# Altium schematic sheet Feeder.SchDoc
size A3; SheetNumber: 1; SheetTotal: 1
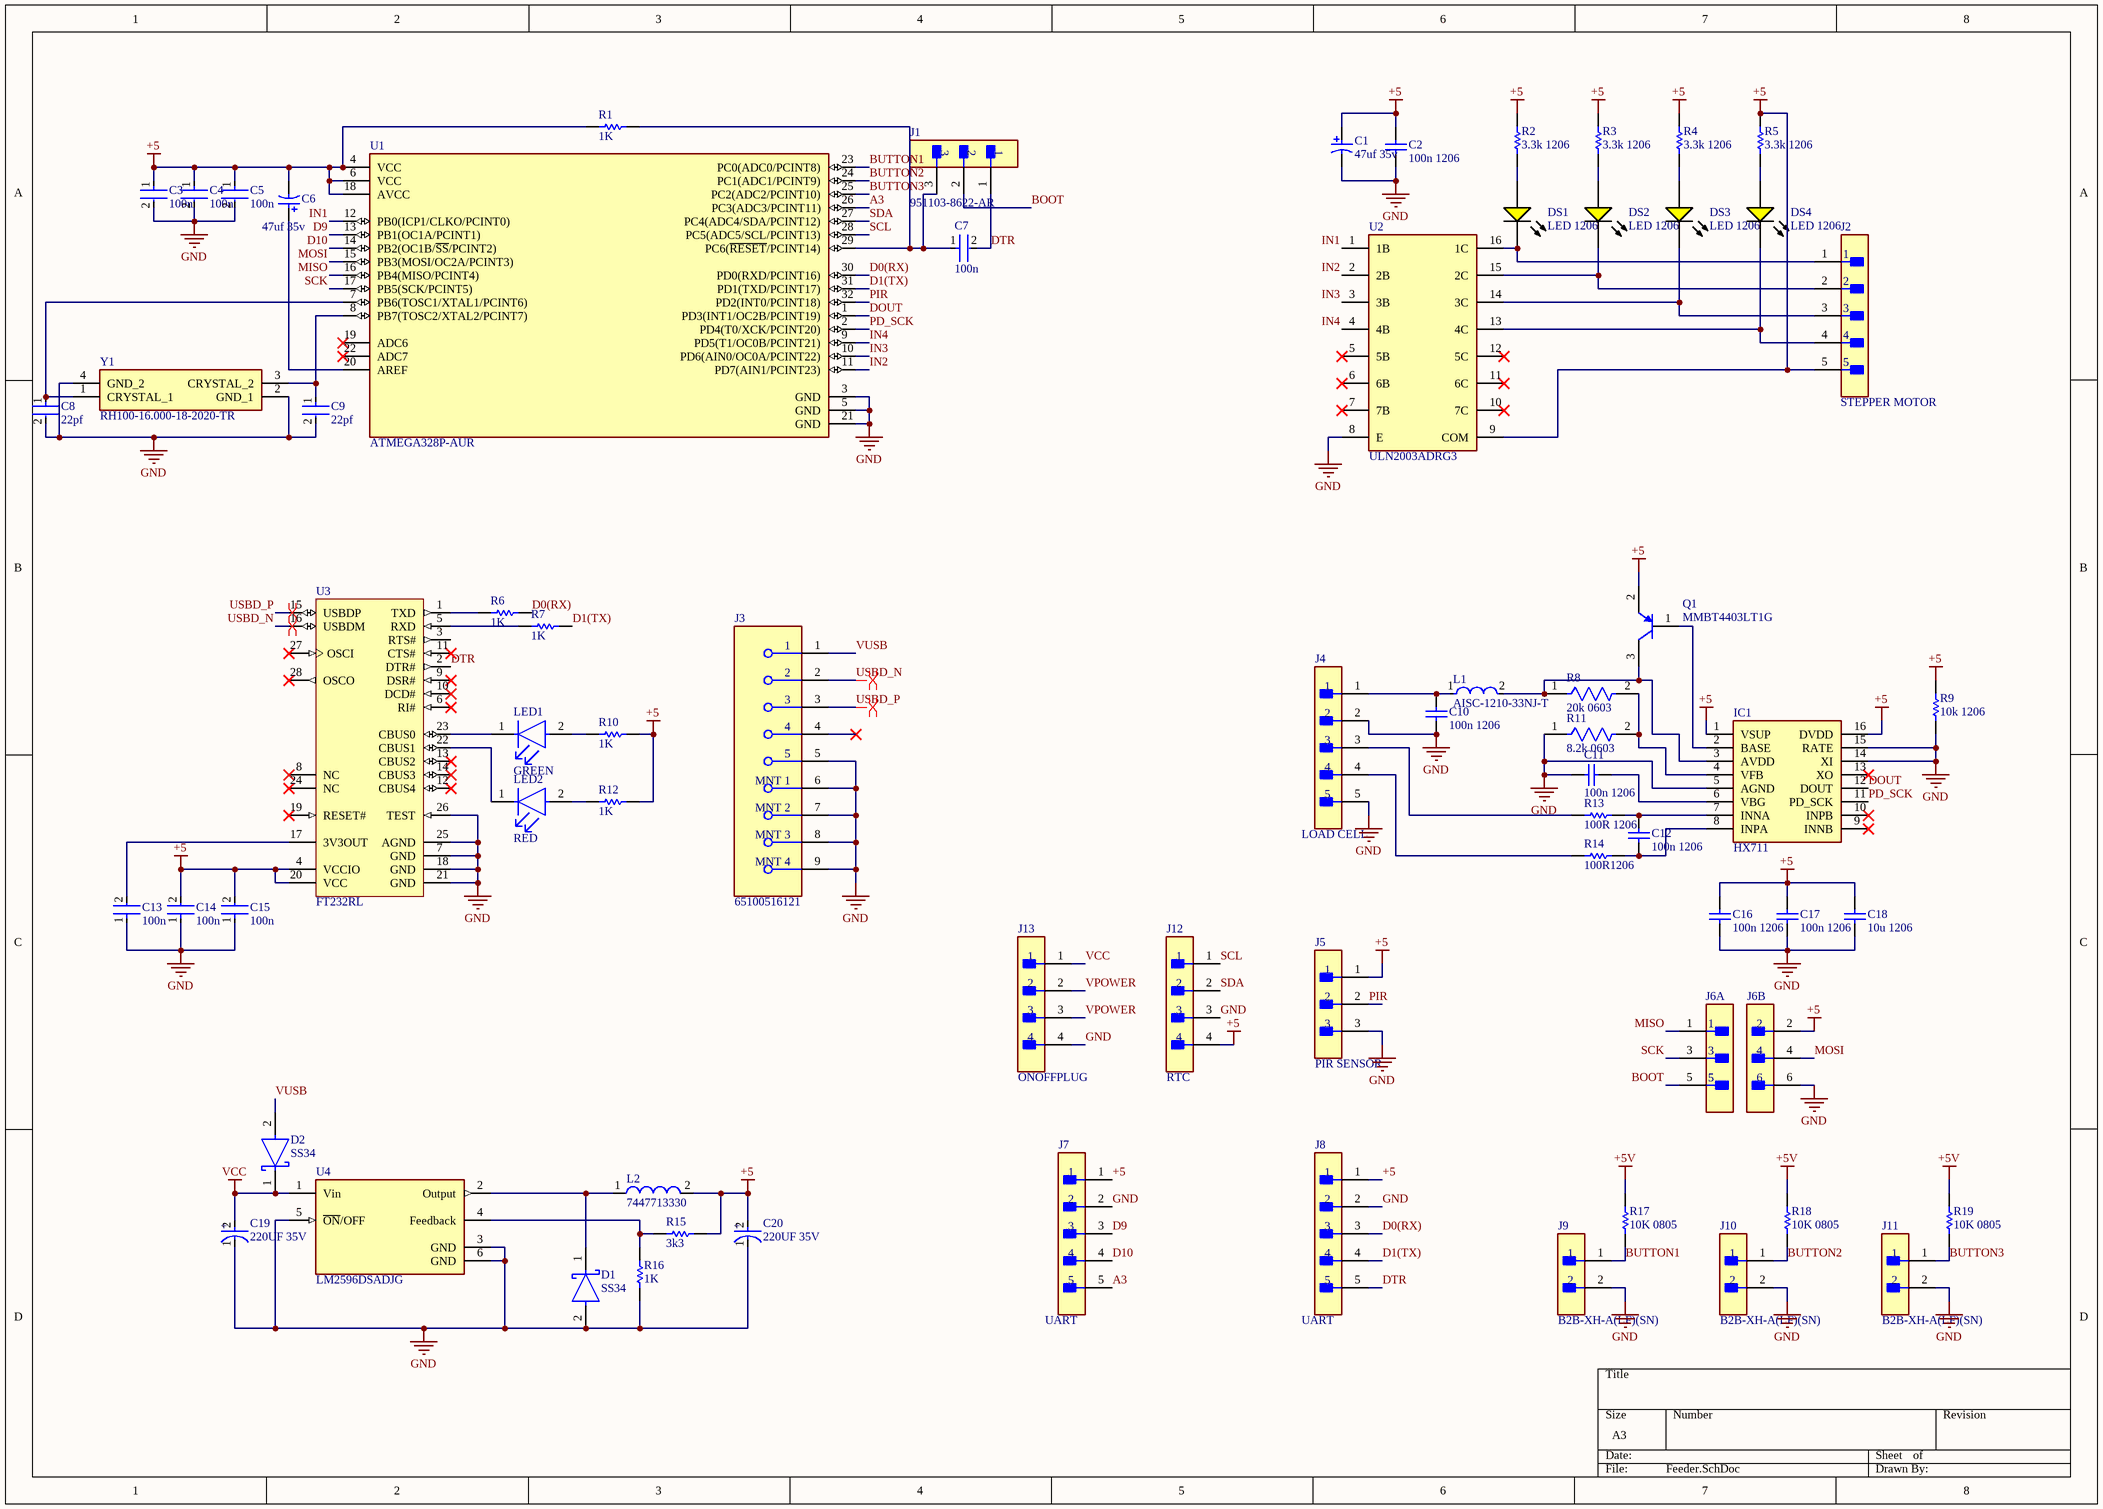
[diagram p0: Feeder.SchDoc]

## Parts
C1  47uf 35v  [NIC-CAPA2-6.3X5.8_V]
C2  100n 1206  [CAPC3216X190X55ML30T25]
C3  100n  [FP-C1206C-EB-MFG]
C4  100n  [FP-C1206C-EB-MFG]
C5  100n  [FP-C1206C-EB-MFG]
C6  47uf 35v  [NIC-CAPA2-6.3X5.8_V]
C7  100n  [FP-C1206C-EB-MFG]
C8  22pf  [FP-C1206C-EB-MFG]
C9  22pf  [FP-C1206C-EB-MFG]
C10  100n 1206  [CAPC3216X190X55ML30T25]
C11  100n 1206  [CAPC3216X190X55ML30T25]
C12  100n 1206  [CAPC3216X190X55ML30T25]
C13  100n  [FP-C1206C-EB-MFG]
C14  100n  [FP-C1206C-EB-MFG]
C15  100n  [FP-C1206C-EB-MFG]
C16  100n 1206  [CAPC3216X190X55ML30T25]
C17  100n 1206  [CAPC3216X190X55ML30T25]
C18  10u 1206  [CAPC3216X190X55ML30T25]
C19  220UF 35V  [FP-FC-G-MFG]
C20  220UF 35V  [FP-FC-G-MFG]
D1  SS34  [FP-SS34LWH-MFG]
D2  SS34  [FP-SS34LWH-MFG]
DS1  LED 1206  [LUMX-SML-LX1206YC-TR_V]
DS2  LED 1206  [LUMX-SML-LX1206YC-TR_V]
DS3  LED 1206  [LUMX-SML-LX1206YC-TR_V]
DS4  LED 1206  [LUMX-SML-LX1206YC-TR_V]
IC1  HX711  [SOIC127P600X160-16N]
J1  951103-8622-AR  [FP-951103-8622-AR-MFG]
J2  STEPPER MOTOR  [FP-B5B-XH-AM_LF_SN-MFG]
J3  65100516121  [FP-65100516121-MFG]
J4  LOAD CELL  [FP-B5B-XH-AM_LF_SN-MFG]
J5  PIR SENSOR  [FP-B3B-XH-A_LF_SN-MFG]
J6  (no value)  [FP-90130-1206-MFG]  (parts A,B of 2)
J7  UART  [FP-B5B-XH-AM_LF_SN-MFG]
J8  UART  [FP-B5B-XH-AM_LF_SN-MFG]
J9  B2B-XH-A(LF)(SN)  [FP-B2B-XH-A_LF_SN-MFG]
J10  B2B-XH-A(LF)(SN)  [FP-B2B-XH-A_LF_SN-MFG]
J11  B2B-XH-A(LF)(SN)  [FP-B2B-XH-A_LF_SN-MFG]
J12  RTC  [FP-B4B-XH-A_LF_SN-MFG]
J13  ONOFFPLUG  [FP-B4B-XH-A_LF_SN-MFG]
L1  AISC-1210-33NJ-T  [FP-AISC-1210-MFG]
L2  7447713330  [WE-PD 1030]
LED1  GREEN  [FP-150120GS75000-MFG]
LED2  RED  [FP-150120GS75000-MFG]
Q1  MMBT4403LT1G  [ONSC-SOT-23-3-318-08_V]
R1  1K  [RESC3216X70X50LL05T20]
R2  3.3k 1206  [RESC3116X65X40ML10T20]
R3  3.3k 1206  [RESC3116X65X40ML10T20]
R4  3.3k 1206  [RESC3116X65X40ML10T20]
R5  3.3k 1206  [RESC3116X65X40ML10T20]
R6  1K  [RESC3216X70X50LL05T20]
R7  1K  [RESC3216X70X50LL05T20]
R8  20k 0603  [FP-RC0603-0_55-IPC_C]
R9  10k 1206  [RESC3116X65X40ML10T20]
R10  1K  [RESC3216X70X50LL05T20]
R11  8.2k 0603  [FP-RC0603-0_55-IPC_C]
R12  1K  [RESC3216X70X50LL05T20]
R13  100R 1206  [RESC3116X65X40ML10T20]
R14  100R1206  [RESC3116X65X40ML10T20]
R15  3k3  [RESC3216X70X50LL05T20]
R16  1K  [RESC3216X70X50LL05T20]
R17  10K 0805  [RESC2013X60X35NL10T20]
R18  10K 0805  [RESC2013X60X35NL10T20]
R19  10K 0805  [RESC2013X60X35NL10T20]
U1  ATMEGA328P-AUR  [FP-32A-IPC_C]
U2  ULN2003ADRG3  [FP-D0016A-IPC_A]
U3  FT232RL  [FTDI-SSOP-28_M]
U4  LM2596DSADJG  [FP-936A-02-MFG]
Y1  RH100-16.000-18-2020-TR  [RH10012000182020TR]

## Nets
+5: C1.1 C2.2 C3.1 C4.1 C5.1 C6.2 C14.2 C15.2 C16.2 C17.2 C18.2 C20.2(A) IC1.1(VSUP) IC1.16(DVDD) J2.5 J5.1 J6.2 J7.1 J8.1 J12.4 L2.2 Q1.2(E) R1.1 R2.2 R3.2 R4.2 R5.2 R9.2 R10.2 R12.2 R15.2 U1.4(VCC) U1.6(VCC) U1.18(AVCC) U2.9(COM) U3.4(VCCIO) U3.20(VCC)
+5V: R17.2 R18.2 R19.2
GND: C1.2 C2.1 C3.2 C4.2 C5.2 C8.2 C9.2 C10.1 C11.2 C13.1 C14.1 C15.1 C16.1 C17.1 C18.1 C19.1(C) C20.1(C) D1.2(A) IC1.5(AGND) IC1.14(XI) IC1.15(RATE) J3.5 J3.6(MNT_1) J3.7(MNT_2) J3.8(MNT_3) J3.9(MNT_4) J4.2 J4.5 J5.3 J6.6 J7.2 J8.2 J9.2 J10.2 J11.2 J12.3 J13.4 R9.1 R11.1 R16.1 U1.3(GND) U1.5(GND) U1.21(GND) U2.8(E) U3.7(GND) U3.18(GND) U3.21(GND) U3.25(AGND) U3.26(TEST) U4.3(GND) U4.5(~{ON}/OFF) U4.6(GND) Y1.2(GND_1) Y1.4(GND_2)
VCC: C19.2(A) D2.1(C) J13.1 U4.1(Vin)
A3: J7.5 U1.26(PC3(ADC3/PCINT11))
BOOT: J1.2 J6.5
BUTTON1: J9.1 R17.1 U1.23(PC0(ADC0/PCINT8))
BUTTON2: J10.1 R18.1 U1.24(PC1(ADC1/PCINT9))
BUTTON3: J11.1 R19.1 U1.25(PC2(ADC2/PCINT10))
D0(RX): J8.3 R6.2 U1.30(PD0(RXD/PCINT16))
D1(TX): J8.4 R7.2 U1.31(PD1(TXD/PCINT17))
D9: J7.3 U1.13(PB1(OC1A/PCINT1))
D10: J7.4 U1.14(PB2(OC1B/~{SS}/PCINT2))
DOUT: IC1.12(DOUT) U1.1(PD3(INT1/OC2B/PCINT19))
DTR: C7.2 J1.1 J8.5 U3.2(DTR#)
IN1: U1.12(PB0(ICP1/CLKO/PCINT0)) U2.1(1B)
IN2: U1.11(PD7(AIN1/PCINT23)) U2.2(2B)
IN3: U1.10(PD6(AIN0/OC0A/PCINT22)) U2.3(3B)
IN4: U1.9(PD5(T1/OC0B/PCINT21)) U2.4(4B)
MISO: J6.1 U1.16(PB4(MISO/PCINT4))
MOSI: J6.4 U1.15(PB3(MOSI/OC2A/PCINT3))
PD_SCK: IC1.11(PD_SCK) U1.2(PD4(T0/XCK/PCINT20))
PIR: J5.2 U1.32(PD2(INT0/PCINT18))
SCK: J6.3 U1.17(PB5(SCK/PCINT5))
SCL: J12.1 U1.28(PC5(ADC5/SCL/PCINT13))
SDA: J12.2 U1.27(PC4(ADC4/SDA/PCINT12))
USBD_N: J3.2 U3.16(USBDM)
USBD_P: J3.3 U3.15(USBDP)
VPOWER: J13.2 J13.3
VUSB: D2.2(A) J3.1
NetC6_1: C6.1 U1.20(AREF)
NetC7_1: C7.1 J1.3 R1.2 U1.29(PC6(~{RESET}/PCINT14))
NetC8_1: C8.1 U1.7(PB6(TOSC1/XTAL1/PCINT6)) Y1.1(CRYSTAL_1)
NetC9_1: C9.1 U1.8(PB7(TOSC2/XTAL2/PCINT7)) Y1.3(CRYSTAL_2)
NetC10_2: C10.2 J4.1 L1.1
NetC11_1: C11.1 IC1.6(VBG)
NetC12_1: C12.1 IC1.8(INPA) R14.2
NetC12_2: C12.2 IC1.7(INNA) R13.2
NetC13_2: C13.2 U3.17(3V3OUT)
NetD1_1: D1.1(C) L2.1 U4.2(Output)
NetDS1_1: DS1.1(A) R2.1
NetDS1_2: DS1.2(K) J2.1 U2.16(1C)
NetDS2_1: DS2.1(A) R3.1
NetDS2_2: DS2.2(K) J2.2 U2.15(2C)
NetDS3_1: DS3.1(A) R4.1
NetDS3_2: DS3.2(K) J2.3 U2.14(3C)
NetDS4_1: DS4.1(A) R5.1
NetDS4_2: DS4.2(K) J2.4 U2.13(4C)
NetIC1_2: IC1.2(BASE) Q1.1(B)
NetIC1_3: IC1.3(AVDD) L1.2 Q1.3(C) R8.1
NetIC1_4: IC1.4(VFB) R8.2 R11.2
NetJ4_3: J4.3 R13.1
NetJ4_4: J4.4 R14.1
NetLED1_1: LED1.1(C) U3.23(CBUS0)
NetLED1_2: LED1.2(A) R10.1
NetLED2_1: LED2.1(C) U3.22(CBUS1)
NetLED2_2: LED2.2(A) R12.1
NetR6_1: R6.1 U3.1(TXD)
NetR7_1: R7.1 U3.5(RXD)
NetR15_1: R15.1 R16.2 U4.4(Feedback)

Not connected (* = marked no-connect by the designer): IC1 9(INNB)* 10(INPB)* 13(XO)*; J3 4*; U1 19(ADC6)* 22(ADC7)*; U2 5(5B)* 6(6B)* 7(7B)* 10(7C)* 11(6C)* 12(5C)*; U3 3(RTS#) 6(RI#)* 8(NC)* 9(DSR#)* 10(DCD#)* 11(CTS#)* 12(CBUS4)* 13(CBUS2)* 14(CBUS3)* 19(RESET#)* 24(NC)* 27(OSCI)* 28(OSCO)*

## Layout directives
differential pair: USBD_N, USBD_P

## Notes on the sheet
- (in symbol CMP-05427-002152-1) +

## Library data of the parts
C1 C6 = CMP-0687-00032-1: Aluminum Electrolytic Capacitor, UD Series, Low Impedance, 47 uF, 35 V, + / - 20%, -55 to 105 degC, Chip Type, 6.3 x 5.8 mm D x L, Pb-Free, Reel; Manufacturer: Nichicon; PartNumber: UUD1V470MCL1GS; Rated Ripple Current (at 100kHz): 230 mA; Endurance Time: 2000 h; Impedance: 0.44 Ohm; Tolerance Rated Capacitance: -20 to 20%; Packing: Dia382mm Reel; DatasheetVersion: 08/2012; Length: 5.8 mm; ComponentLink2URL: http://products.nichicon.co.jp/en/pdf/XJA043/e-ud.pdf; PackageDescription: 2-Pin Surface Mount Device, Diameter 6.3 mm, Height 5.8 mm, Pitch 5.4 mm; ComponentLink2Description: Datasheet; Diameter: 6.3 mm; ComponentLink1URL: http://www.nichicon.co.jp/; Rated Voltage: 35 V; Mounting Technology: Surface Mount; ComponentLink3Description: Package Specification; ComponentLink1Description: Manufacturer URL; ComponentLink3URL: http://products.nichicon.co.jp/en/pdf/XJA043/e-ud.pdf; RoHS: TRUE; PackageReference: CAPAE-D6.3H5.8; Rated Capacitance: 47 uF
C2 C10-C12 C16 C17 = CMP-1662-00011-2: Chip Capacitor, 100 uF, +/- 20%, 6.3 V, -55 to 85 degC, 1206 (3216 Metric), RoHS, Tape and Reel; PartNumber: GRM31CR60J107ME39L; Case\/Package: 1206; Capacitance: 100 uF; Voltage Rating (DC): 6.3 V; Type (Capacitors): X5R; REACH SVHC: No SVHC; Height: 1.6 mm; Tolerance: 20%; Packaging: Tape and Reel; Mount: Surface Mount; PackageDescription: 2-Pin Surface Mount Device, Body 3.2 x 1.6 mm; ComponentLink1URL: http://www.murata.com/; Pins: 2; ComponentLink2Description: Datasheet; PackageReference: 1206; Width: 1.6 mm; Package Quantity: 2000; Min Operating Temperature: -55 degC; Case Code (Imperial): 1206; Max Operating Temperature: 85 degC; DatasheetVersion: 09/2016; Mounting Technology: Surface Mount; Voltage Rating: 6.3 V; ComponentLink1Description: Manufacturer URL; Radiation Hardening: No; Case Code (Metric): 3216; Length: 3.2 mm; ComponentLink2URL: http://psearch.en.murata.com/capacitor/product/GRM31CR60J107ME39%23.pdf; RoHSCompliant: true
C3-C5 C7 C13-C15 = CMP-1037-04189-2: CAP CER 0.1UF 25V 5% NP0 1206; Manufacturer: KEMET; Manufacturer Part Number: C1206C104J3GACTU; Value: 0.10 μF; Tolerance: 0.05; Temperature Coefficient: 15%; Automotive Grade: Grade 0; Material: Ceramic; Temperature Characteristic: C0G; Automotive: Yes; Ipc Land Pattern Name: CAPC320160X78; ComponentLink2Description: Datasheet; Height: 0.88mm; Digikey Description: CAP CER 0.1UF 25V 5% NP0 1206; Capacitance: 0.10 μF; Category: Cap; Package: C1206C-EB; Device Class L3: Ceramic Capacitors; Octopart: https://octopart.com/c1206c104j3gactu-kemet-9145095; Device Class L1: Passive Components; Device Class L2: Capacitors; Voltage Rating: 25 V; Lead Free: Yes; Mouser Description: Multilayer Ceramic Capacitors MLCC - SMD/SMT 25volts 0.1uF 5% C0G; Temperature: -55°C to +150°C; ComponentLink2URL: https://content.kemet.com/datasheets/KEM_C1007_X8R_ULTRA_150C_SMD.pdf; RoHS: TRUE; Temperature Range High: +150°C; Temperature Range Low: -55°C
C8 C9 = CMP-1037-00978-2: 1206 22pF Ceramic Multilayer Capacitor; 50VDC; 125degC; C0G Dielec; +/-5% SMD; Manufacturer Part Number: C1206C220J5GACTU; Manufacturer: KEMET; Automotive Grade: Grade 0; Temperature Coefficient: 15%; Tolerance: 0.05; Voltage Rating: 50 V; Height: 0.88mm; Mouser Description: 1206 22pF Ceramic Multilayer Capacitor; 50VDC; 125degC; C0G Dielec; +/-5% SMD; Ipc Land Pattern Name: CAPC320160X78; Temperature Range High: +150°C; Automotive: Yes; Device Class L3: Ceramic Capacitors; ComponentLink2Description: Datasheet; Temperature: -55°C to +150°C; Lead Free: Yes; Category: Cap; Device Class L2: Capacitors; Device Class L1: Passive Components; Value: 22 pF; Capacitance: 22 pF; Digikey Description: 1206 22pF Ceramic Multilayer Capacitor; 50VDC; 125degC; C0G Dielec; +/-5% SMD; Octopart: https://octopart.com/c1206c220j5gactu-kemet-131912; Material: Ceramic; Temperature Characteristic: C0G; Package: C1206C-EB; RoHS: TRUE; ComponentLink2URL: https://content.kemet.com/datasheets/KEM_C1007_X8R_ULTRA_150C_SMD.pdf; Temperature Range Low: -55°C
C18 = CMP-1662-00011-2: Chip Capacitor, 10 uF, +/- 20%, 6.3 V, -55 to 85 degC, 1206 (3216 Metric), RoHS, Tape and Reel; PartNumber: GRM31CR60J107ME39L; Case\/Package: 1206; Capacitance: 100 uF; Voltage Rating (DC): 6.3 V; Type (Capacitors): X5R; REACH SVHC: No SVHC; Height: 1.6 mm; Tolerance: 20%; Packaging: Tape and Reel; Mount: Surface Mount; PackageDescription: 2-Pin Surface Mount Device, Body 3.2 x 1.6 mm; ComponentLink1URL: http://www.murata.com/; Pins: 2; ComponentLink2Description: Datasheet; PackageReference: 1206; Width: 1.6 mm; Package Quantity: 2000; Min Operating Temperature: -55 degC; Case Code (Imperial): 1206; Max Operating Temperature: 85 degC; DatasheetVersion: 09/2016; Mounting Technology: Surface Mount; Voltage Rating: 6.3 V; ComponentLink1Description: Manufacturer URL; Radiation Hardening: No; Case Code (Metric): 3216; Length: 3.2 mm; ComponentLink2URL: http://psearch.en.murata.com/capacitor/product/GRM31CR60J107ME39%23.pdf; RoHSCompliant: true
C19 C20 = CMP-05427-002152-1: CAP ALUM 220UF 20% 35V SMD; Life (Hours): 1000Hour; Leakage Current: 3uA; Ripple Current (AC): 670mA; Material: Aluminium; Impedance: 150mR; Mount: Surface Mount; Construction: Cylindrical; Ratings: AEC-Q200; Radiation Hardening: No; Height: 10.2mm; Height - Seated (Max): 0.402inch; Termination: SMD/SMT; Tolerance: 20%; Packaging: Tape and Reel; Min Operating Temperature: -40°C; Voltage: 35V; Case/Package: Radial; Length: 10.5mm; Ripple Current: 670mA; Contact Plating: Tin; Width: 900um; Capacitance: 220uF; Voltage Rating (DC): 35V; Diameter: 10mm; Package Quantity: 500; Lead Free: Lead Free; Reach SVHC Compliant: Yes; Series: FC; Max Operating Temperature: 105°C; Voltage Rating: 35V; RoHS Compliant: Yes; ESR (Equivalent Series Resistance): 150mR
D1 D2 = CMP-15604-000001-1: DIODE SCHOTTKY 40V 3A SOD123W; RoHS Compliant: Yes
DS1-DS4 = CMP-2000-07124-1: Yellow LED, Water Clear Len, 585 nm, 2.1 V, -40 to 85 degC, 2-Pin SMD, RoHS, Tape and Reel; Manufacturer: Lumex; Product Training Modules: LEDsBenefitsofCustomLEDandLCDTechnology; Millicandela Rating: 6mcd; Catalog Drawings: SML-LX1206SeriesTopSML-LX1206SeriesSideSML-LX1206SeriesBottomSML-LX1206SeriesFootprint; Wavelength - Peak: 585nm; Other Names: 67-1358-2LU60357TRSMLLX1206YCTR; Lens Style/Size: RectanglewithFlatTop; Current - Test: 20mA; Lens Color: Colorless; Viewing Angle: 160°; Voltage - Forward (Vf) (Typ): 2.1V; Online Catalog: SML-LX1206RectanglewithFlatTop1206PackageLEDs; Mounting Type: SurfaceMount; Package Description: 2-Pin Surface Mount Device, Body 3.2 x 1.5 mm; Datasheet Version: Rev. K, 08/2012; Features: -; Color: Yellow; RoHS Information: RoHSCertofCompliance; Package Reference: SML-LX1206YC-TR; Supplier Device Package: 1206; Standard Package: 3,000; Series: -; Wavelength - Dominant: -; Package / Case: 1206(3216Metric); Mounting Technology: SurfaceMount; Height (Max): 1.10mm; Lens Transparency: Clear; Datasheet URL: http://www.lumex.com/content/files/ProductAttachment/SML-LX1206YC-TR.pdf; Family: LEDIndication-Discrete; Manufacturer URL: http://www.lumexinstruments.com/; Packaging: Tape&Reel(TR); Category: Optoelectronics; Size / Dimension: 3.20mmLx1.60mmW
IC1 = HX711: Integrated Circuit; Manufacturer_Name: AVIA; Datasheet Link: https://cdn.sparkfun.com/datasheets/Sensors/ForceFlex/hx711_english.pdf; Height: 1.6mm; Manufacturer_Part_Number: HX711
J1 = CMP-05379-000003-1: CONN HEADER VERT 3POS 2MM; Manufacturer: 3M; Conn Gender: Male; Current Rating: 2A; Number Of Contacts: 3; Conn Orientation: Straight; Digikey Description: CONN HEADER VERT 3POS 2MM; Device Class L3: unset; Category: Conn; Height: 6.3mm; Manufacturer Part Number: 951103-8622-AR; RoHS: TRUE; Contact Material: Gold,Nickel; ComponentLink2Description: Datasheet; Temperature Range Low: -55°C; Device Class L1: Connectors; Pitch: 2mm; Mouser Description: Header; PinStrip; CopperAlloy; HighTempThermoplastic; 3Cnts; 1A; RtAngle; 951Series; Octopart: https://octopart.com/951103-8622-ar-3m-14400669; Package: 951103-8622-AR; Lead Free: Yes; Device Class L2: Headers and Wire Housings; Temperature Range High: +125°C; ComponentLink2URL: http://multimedia.3m.com/mws/media/1400506O/3m-pin-strip-header-951-series-78-5100-2653-3.pdf; Automotive: No; Temperature: -55°C to +125°C; Number Of Rows: 1
J2 J4 J7 J8 = CMP-17439-000304-1: CONN HEADER VERT 5POS 2.5MM B5B-XH-AM(LF)(SN); Mated Stacking Heights: 9.8mm; Voltage Rating: 250V; Max Current Rating: 3A; Number of Positions: 5; Contact Resistance: 20mR; Depth: 5.75mm; Connector Type: Header; Color: Green; Insulation Material: Nylon; Contact Plating: Copper; Length: 14.9mm; Fastening Type: Detent; Contact Material: Brass; Number of Rows: 1; Contact Type: Male Pin; Housing Material: Polyamide; Housing Color: White; Lead Free: Lead Free; Max Voltage Rating (AC): 250V; Mount: Through Hole; Contact Shape: Square; Min Operating Temperature: -25°C; Packaging: Bulk; Orientation: Straight; Insulation Color: Natural; Series: XH; Flammability Rating: UL94 V-0; Contact Finish - Mating: TIN; Max Operating Temperature: 85°C; Termination: Solder; Pitch: 2.5mm
J3 = CMP-2000-05576-2: CONN RCPT USB2.0 MINI B SMD R/A; Insulation Resistance: 1GR; Current Rating: 1A; Working Voltage: 30V; Number of Ports: 1; Connector Type: USB; Gender: Receptacle; Number of Contacts: 5; Contact Resistance: 20mR; Mating Cycles: 1500; Shielding: Shielded; Max Operating Temperature: 105°C; USB Standard: USB 2.0; Color: Black; Series: WR-COM; Min Operating Temperature: -40°C; Mount: Surface Mount; Length: 7.7mm; Termination: Solder; Voltage Rating: 30V; Flammability Rating: UL94 V-0; Width: 9.25mm; Insulation Color: Black; Contact Material: Copper Alloy; Contact Plating: Gold; Orientation: Right Angle; Packaging: Tape and Reel; Lead Free: Lead Free; Package Quantity: 1; Number of Positions: 5
J5 = CMP-17439-000014-3: CONN HEADER VERT 3POS 2.5MM; Max Voltage Rating (DC): 250V; Number of Positions: 3; Current Rating: 3A; Gender: Male; Wire/Cable Gauge: 22AWG; Contact Resistance: 20mR; Insulation Resistance: 1GR; Insulation Material: Nylon; Contact Plating: Tin; Depth: 5.75mm; Contact Type: Male Pin; Max Operating Temperature: 85°C; Insulation Color: Natural; Voltage Rating (AC): 250V; Color: Natural; Connector Type: Header; Orientation: Straight; Fastening Type: Detent; Housing Color: White; Min Operating Temperature: -25°C; Termination: Solder; Voltage Rating: 250V; Series: XH; Pitch: 2.5mm; Contact Shape: Square; Number of Rows: 1; Lead Free: Lead Free; Packaging: Bulk; Mount: Through Hole; Flammability Rating: UL94 V-0; Max Voltage Rating (AC): 250V; REACH SVHC: No SVHC; Housing Material: Polyamide; Contact Material: Brass; Lead Pitch: 2.5mm; Contact Finish - Mating: TIN; Length: 9.9mm; Max Current Rating: 3A; Number of Contacts: 3
J6 = CMP-04776-000468-1: CONN HEADER VERT 6POS 2.54MM; Number of Contacts: 6; Contact Resistance: 20mR; Voltage Rating: 350V; Glow Wire Compliant: Non-compliant; Max Voltage Rating (AC): 500V; Max Voltage Rating (DC): 350.35kV; Insulation Resistance: 5GR; Max Current Rating: 3.9A; Current Rating: 3A; Gender: Male; Termination: Solder; Depth: 3.94mm; Height: 4.7mm; Color: Black; Material: Glass; Contact Material: Brass; Min Operating Temperature: -55°C; Max Operating Temperature: 125°C; Radiation Hardening: No; Number of Rows: 2; Series: 90130; Contact Plating: Gold; Mount: Through Hole; Pitch: 2.54mm; Package Quantity: 2560; Housing Color: Black; Packaging: Tray; Row Spacing: 2.54mm; Length: 8mm; Voltage Rating (AC): 350V; Working Voltage: 350V; Voltage Rating (DC): 350V; Lead Free: Lead Free; Number of Circuits: 6; Number of Positions: 6; Orientation: Vertical; Number of Poles: 6; Housing Material: Polyester; Lead Pitch: 2.54mm; Contact Gender: Male
J9-J11 = CMP-2000-05888-3: CONN HEADER VERT 2POS 2.5MM; Current Rating: 3A; Voltage Rating: 250V; Number of Contacts: 2; Contact Resistance: 20mR; Wire/Cable Gauge: 22AWG; Insulation Resistance: 1GR; Connector Type: Male Pin; Packaging: Bulk; Contact Material: Brass; Lead Free: Lead Free; Orientation: Straight; Contact Plating: Tin; Max Current Rating: 3A; Termination: Solder; Fastening Type: Detent; Depth: 5.75mm; Housing Material: Polyamide; REACH SVHC: No SVHC; Series: XH; Voltage Rating (AC): 250V; Number of Positions: 2; Color: Natural; Contact Type: Male Pin; Max Voltage Rating (DC): 250V; Pitch: 2.5mm; Lead Pitch: 2.5mm; Mount: Through Hole; Max Operating Temperature: 85°C; Length: 7.4mm; Max Voltage Rating (AC): 250V; Min Operating Temperature: -25°C; Number of Rows: 1; Housing Color: White
J12 J13 = CMP-17439-000250-1: CONN HEADER VERT 4POS 2.5MM; Number of Contacts: 4; Contact Resistance: 20mR; Voltage Rating: 250V; Max Current Rating: 3A; Gender: Male; Wire/Cable Gauge: 22AWG; Mated Stacking Heights: 9.8mm; Insulation Resistance: 1GR; Orientation: Straight; Contact Type: Male Pin; Contact Finish - Mating: TIN; Series: XH; Max Voltage Rating (AC): 250V; Lead Pitch: 2.5mm; Contact Shape: Square; Insulation Color: Natural; Termination: Solder; Lead Free: Lead Free; Voltage Rating (AC): 250V; Number of Rows: 1; Flammability Rating: UL94 V-0; Number of Positions: 4; Max Operating Temperature: 85°C; Package Quantity: 500; Mount: Through Hole; REACH SVHC: No SVHC; Connector Type: Header; Insulation Material: Nylon; Fastening Type: Detent; Min Operating Temperature: -25°C; Housing Color: White; Packaging: Bulk; Contact Plating: Tin; Contact Material: Brass; Max Voltage Rating (DC): 250V; Housing Material: Polyamide; Color: Natural; Material: Polyamide; Pitch: 2.5mm; Depth: 5.75mm; Current Rating: 3A; Length: 12.4mm
L1 = CMP-27750-000226-1: Unshielded Wirewound Inductor 33nH 5% 1000mA 0.11Ω SMD; Max DC Current: 1A; Test Frequency: 100MHz; Q Factor: 55; Self Resonant Frequency: 1.8GHz; DC Resistance (DCR): 110mR; Core Material: Ceramic; RoHS Compliant: Yes; Inductance: 33nH; Package Quantity: 1000; Weight: 0.000564oz; Max Operating Temperature: 125°C; Height: 2.7mm; Resistor Type: Ceramic; Shielding: Unshielded; Packaging: Tape and Reel; Case/Package: Nonstandard; Width: 2.95mm; Mount: Surface Mount; Current Rating: 1A; Length: 0.144inch; Min Operating Temperature: -40°C; Termination: SMD/SMT; Tolerance: 5%; Height - Seated (Max): 0.106inch
L2 = CMP-1396-00014-1: SMD-Shielded Power Inductor WE-PD, L=33.0 µH; Manufacturer: Wuerth Elektronik; Inductance: 33.0 ÂµH; PartNumber: 7447713330; ComponentLink2Description: Datasheet; ComponentLink2URL: http://www.we-online.de/katalog/media/pdf/7447713330.pdf; ComponentLink1URL: http://www.we-online.com; ComponentLink1Description: Manufacturer URL; PackageReference: WE-PD 1030
LED1 LED2 = CMP-1426-00014-2: LED GREEN CLEAR 1206 SMD; Viewing Angle: 140°; Wavelength: 520nm; Lens Size: 1.6mm; Lens Color: Colorless; Test Current: 20mA; Luminous Intensity: 450mcd; Forward Current: 30mA; Forward Voltage: 3.2V; Packaging: Cut Tape; Height: 0.69mm; Width: 1.6mm; Lens Transparency: Clear; Color: Green; Mount: Surface Mount; Lens Style: Clear; Case/Package: 1206; Case Code (Metric): 3216; Case Code (Imperial): 1206; Package Quantity: 1; RoHS Compliant: Yes; Dominant Wavelength: 520nm; Min Operating Temperature: -40°C; Max Operating Temperature: 85°C; Series: WL-SMCW; Length: 3.2mm
Q1 = CMP-1048-00539-1: Switching Transistor, PNP Silicon, 3-Pin SOT-23, Pb-Free, Tape and Reel; Manufacturer: On Semiconductor; fT Min (MHz): 200; IC Continuous (A): -0.6; ComponentLink1URL: http://www.onsemi.com/; ComponentLink2URL: http://www.onsemi.cn/pub_link/Collateral/MMBT4403LT1-D.PDF; PackageVersion: Rev. AP, 11/2009; ComponentLink1Description: Manufacturer URL; PackageDescription: 3-Pin Small Outline Transistor, Body 2.92 x 1.3 mm, Pitch 0.95 mm; Polarity: PNP; ComponentLink3Description: Package Specification; DatasheetVersion: Rev. 12; Mounting Technology: Surface Mount; PackageReference: SOT-23-3-318-08; ComponentLink3URL: http://www.onsemi.cn/pub_link/Collateral/318-08.PDF; Packing: Tape and Reel; PartNumber: MMBT4403LT1G; RoHS: TRUE; ComponentLink2Description: Datasheet
R1 R6 R7 R10 R12 R15 R16 = CMP-2003-00017-1: Manufacturer: Panasonic; Part Number: ERJ-8ENF1001V
R2-R5 = CMP-2100-03678-1: Chip Resistor, 3.3 KOhm, +/- 1%, 0.25 W, -55 to 155 degC, 1206 (3216 Metric), RoHS, Tape and Reel; Manufacturer: Yageo; Temperature Coefficient: 100ppm/degreesC; Power Rating: 250mW; Voltage Rating: 200V; Resistance: 1KOhm; Composition: ThickFilm; Min Operating Temperature: -55degC; Tolerance: 1%; REACH SVHC: Unknown; Case Code (Metric): 3216; Military Standard: Not; Datasheet Version: Rev. 5, 10/2016; Package Reference: 1206.0; Case/Package: 1206; Length: 3.1mm; Manufacturer URL: http://www.yageo.com/; Lead Free: LeadFree; RoHSCompliant: true; Termination: SMD/SMT; Packaging: TapeandReel; Package Description: 2-Pin Surface Mount Device, Body 3.1 x 1.6 mm; Depth: 1.6mm; Case Code (Imperial): 1206; Max Operating Temperature: 155degC; Datasheet URL: http://www.yageo.com/NewPortal/yageodocoutput?fileName=/pdf/R-Chip/PYu-RC_Group_51_RoHS_L_5.pdf; Height: 0.55mm
R8 = CMP-1659-00009-5: RES 20kK OHM 1% 1/10W 0603; Resistance: 1kR; Voltage Rating: 50V; Power Rating: 100mW; Temperature Coefficient: 100ppm/°C; Military Standard: Not; REACH SVHC: No SVHC; Size Code: 0603; Features: Moisture Resistant; Number of Terminations: 2; Technology: THICK FILM; Series: RC; Case Code (Metric): 1608; Resistance Tolerance: 1%; Resistor Type: Thick Film; Termination: SMD/SMT; Contact Plating: Tin; Radiation Hardening: No; Min Operating Temperature: -55°C; Max Operating Temperature: 155°C; Packaging: Tape and Reel; Max Power Dissipation: 100mW; RoHS Compliant: Yes; Height: 0.45mm; Lead Free: Lead Free; Case/Package: 0603; Length: 1.6mm; Tolerance: 1%; Case Code (Imperial): 0603; Construction: Rectangular; Depth: 0.8mm
R9 = CMP-2100-03678-1: Chip Resistor, 10 KOhm, +/- 1%, 0.25 W, -55 to 155 degC, 1206 (3216 Metric), RoHS, Tape and Reel; Manufacturer: Yageo; Temperature Coefficient: 100ppm/degreesC; Power Rating: 250mW; Voltage Rating: 200V; Resistance: 1KOhm; Composition: ThickFilm; Min Operating Temperature: -55degC; Tolerance: 1%; REACH SVHC: Unknown; Case Code (Metric): 3216; Military Standard: Not; Datasheet Version: Rev. 5, 10/2016; Package Reference: 1206.0; Case/Package: 1206; Length: 3.1mm; Manufacturer URL: http://www.yageo.com/; Lead Free: LeadFree; RoHSCompliant: true; Termination: SMD/SMT; Packaging: TapeandReel; Package Description: 2-Pin Surface Mount Device, Body 3.1 x 1.6 mm; Depth: 1.6mm; Case Code (Imperial): 1206; Max Operating Temperature: 155degC; Datasheet URL: http://www.yageo.com/NewPortal/yageodocoutput?fileName=/pdf/R-Chip/PYu-RC_Group_51_RoHS_L_5.pdf; Height: 0.55mm
R11 = CMP-1659-00009-5: RES 8.2K OHM 1% 1/10W 0603; Resistance: 1kR; Voltage Rating: 50V; Power Rating: 100mW; Temperature Coefficient: 100ppm/°C; Military Standard: Not; REACH SVHC: No SVHC; Size Code: 0603; Features: Moisture Resistant; Number of Terminations: 2; Technology: THICK FILM; Series: RC; Case Code (Metric): 1608; Resistance Tolerance: 1%; Resistor Type: Thick Film; Termination: SMD/SMT; Contact Plating: Tin; Radiation Hardening: No; Min Operating Temperature: -55°C; Max Operating Temperature: 155°C; Packaging: Tape and Reel; Max Power Dissipation: 100mW; RoHS Compliant: Yes; Height: 0.45mm; Lead Free: Lead Free; Case/Package: 0603; Length: 1.6mm; Tolerance: 1%; Case Code (Imperial): 0603; Construction: Rectangular; Depth: 0.8mm
R13 R14 = CMP-2100-03675-1: Chip Resistor, 100 Ohm, +/- 1%, 0.25 W, -55 to 155 degC, 1206 (3216 Metric), RoHS, Tape and Reel; Manufacturer: Yageo; Voltage Rating: 200V; Power Rating: 250mW; Resistance: 100Ohm; Temperature Coefficient: 100ppm/degreesC; Case Code (Imperial): 1206; Datasheet Version: Rev. 5, 10/2016; Case Code (Metric): 3216; Packaging: TapeandReel; Composition: ThickFilm; Height: 0.55mm; Lead Free: LeadFree; Depth: 1.6mm; Package Reference: 1206.0; Termination: SMD/SMT; Case/Package: 1206; Package Quantity: 5000; Datasheet URL: http://www.yageo.com/NewPortal/yageodocoutput?fileName=/pdf/R-Chip/PYu-RC_Group_51_RoHS_L_5.pdf; REACH SVHC: Unknown; Max Operating Temperature: 155degC; Length: 3.1mm; Manufacturer URL: http://www.yageo.com/; Min Operating Temperature: -55degC; Tolerance: 1%; RoHSCompliant: true; Width: 1.6mm; Package Description: 2-Pin Surface Mount Device, Body 3.1 x 1.6 mm
R17-R19 = CMP-1659-00013-4: Chip Resistor, 10 KOhm, +/- 1%, 0.125 W, -55 to 155 degC, 0805 (2012 Metric), RoHS, Tape and Reel; Manufacturer: Yageo; Voltage Rating: 150 V; Mount: Surface Mount; ComponentLink1Description: Manufacturer URL; ComponentLink2URL: http://www.yageo.com/documents/recent/PYu-RC_Group_51_RoHS_L_04.pdf; Pins: 2; Length: 2 mm; Min Operating Temperature: -55 degC; Height: 0.5 mm; Mounting Technology: Surface Mount; RoHSCompliant: true; REACH SVHC: No SVHC; ComponentLink1URL: http://www.yageo.com/; Max Operating Temperature: 155 degC; PackageReference: 0805; DatasheetVersion: Rev. 4, 02/2016; Package Quantity: 5000; Packaging: Tape and Reel; ComponentLink2Description: Datasheet; PackageDescription: 2-Pin Surface Mounted Device, Body 2 x 1.25 mm
U1 = CMP-06276-000046-1: IC MCU 8BIT 32KB FLASH 32TQFP; Number of I/Os: 32; Oscillator Type: Internal; Peripherals: Brown-out Detect/Reset; Core Architecture: PIC; Interface: I2C; Frequency: 40MHz; Case/Package: TQFP; Max Operating Temperature: 85°C; Min Operating Temperature: -40°C; Memory Size: 32KB; Packaging: Cut Tape; Memory Type: FLASH
U2 = CMP-04912-000074-1: TRANS 7NPN DARL 50V 0.5A 16SOIC; Polarity: NPN; Number of Elements: 7; Collector Emitter Saturation Voltage: 1.1V; Max Collector Current: 500mA; Continuous Collector Current: 820uA; Collector Emitter Voltage (VCEO): 50V; Number of Pins: 16; Max Operating Temperature: 70°C; Weight: 0.004998oz; RoHS Compliant: Yes; Mount: Surface Mount; Radiation Hardening: No; Min Operating Temperature: -20°C; Series: -; Contact Plating: Tin; Lead Free: Lead Free; Case/Package: SOIC; Number of Drivers: 7; Package Quantity: 1; Collector-emitter Voltage-Max: 50V; Packaging: Tape and Reel
U3 = CMP-2000-05029-1: IC USB FS SERIAL UART 28-SSOP; Manufacturer: FTDI; Receive FIFO: 256B; Number of Channels per Chip: 1; Maximum Data Rate: 3MBd; Transmit FIFO: 128B; Dimensions: 10.2x5.3x1.75mm; Mounting Type: SurfaceMount; Height: 1.75mm; Package Type: SSOP; Datasheet Version: Rev. 1.04, 02/2006; Width: 5.3mm; Manufacturer URL: http://www.ftdichip.com/; Datasheet URL: http://datasheet.octopart.com/FT232RL-FTDI-datasheet-120501.pdf; Maximum Operating Temperature: +85degC; Minimum Operating Temperature: -40degC; Pin Count: 28; Length: 10.2mm
U4 = CMP-07129-000001-1: IC REG MULT CONFG ADJ 3A D2PAK-5; Manufacturer: ON Semiconductor; Max Duty Cycle: 95%; Nominal Supply Current: 5mA; Standoff Height: 0mm; Min Supply Voltage: 4.5V; Output Voltage: 1.23-37V; Negative Voltage Available: true; Number Of Outputs: 1; Max Junction Temp: +125°C; Output Type: AdjustableProgrammable; Max Supply Voltage: 40V; Switching Topology: Boost,Buck,Buck-Boost; Switching Frequency: 150Hz; Output Current: 3A; Device Class L1: Integrated Circuits (ICs); Height: 4.826mm; Manufacturer Part Number: LM2596DSADJG; ComponentLink2URL: https://www.onsemi.com/pub/Collateral/LM2596-D.PDF; Device Class L3: Voltage Regulators - Switching; Octopart: https://octopart.com/lm2596dsadjg-on+semiconductor-12437034; Mouser Description: Voltage Regulators - Switching Regulators 3A BUCK SWCH 150KHZ; Automotive: No; RoHS: TRUE; Temperature Range High: +125°C; ComponentLink2Description: Datasheet; Device Class L2: Power Management ICs; Digikey Description: IC REG MULT CONFG ADJ 3A D2PAK-5; Temperature Range Low: -40°C; Footprint Url: https://www.onsemi.com/pub/Collateral/936A-02.PDF; Lead Free: Yes; Temperature: -40°C to +125°C; Package: 936A-02; Category: IC
Y1 = RH100-12.000-18-2020-TR: Crystal or Oscillator; Manufacturer_Name: RALTRON; Datasheet Link: http://www.raltron.com/wp-content/uploads/2017/08/RH100_SERIES-August-2017.pdf; Height: 0.8mm; Manufacturer_Part_Number: RH100-12.000-18-2020-TR